# Altium schematic sheet [13] - I2C_EEPROM.SchDoc
size A4
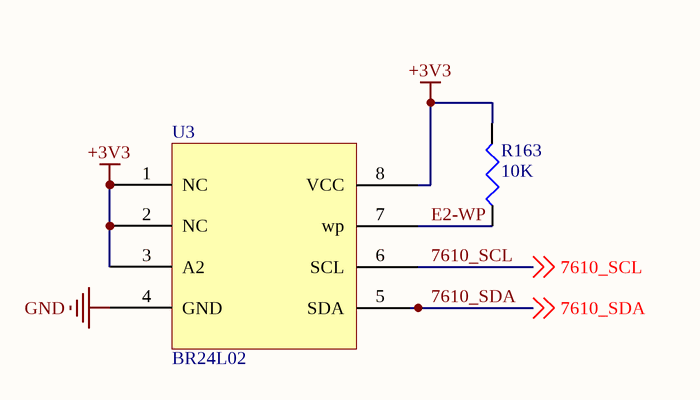
[diagram p0: [13] - I2C_EEPROM.SchDoc]

## Parts
R163  10K  [R0402]
U3  BR24L02  [SO-8]

## Nets
+3V3: R163.2 U3.1(NC) U3.2(NC) U3.3(A2) U3.8(VCC)
GND: U3.4(GND)
7610_SCL: U3.6(SCL) ; off-sheet 7610_SCL
7610_SDA: U3.5(SDA) ; off-sheet 7610_SDA
E2-WP: R163.1 U3.7(wp)

## Library data of the parts
R163 = RC0402FR-071RL: RES 1.00 OHM 1/16W 1% 0402 SM; Manufacturer: Yageo; Resistance (Ohms): 1; Power (Watts): 0.063W, 1/16W; Tolerance: ?%; Value: 1R; .Checked PCB: used; Temperature Coefficient: ?00ppm/癈; Category: Resistors; Manufacturer Part Number: RC0402FR-071RL; Package / Case: 0402 (1005 Metric); Price 1k [$]: 0.01421; .Checked SCH: used; Supplier Part Number: 311-1.00LRCT-ND; Supplier: Digikey; Supplier 1: Digi-Key; Supplier Part Number 1: 311-1.00LRCT-ND; RoHS: RoHS Compliant; Stock 1: 347765; Pricing 1: 10=0.019, 50=0.0142, 100=0.0109, 250=0.00808, 500=0.00596, 1000=0.00397 (USD); Composition: Thick Film; Features: -; Size / Dimension: 0.039" L x 0.020" W (1.00mm x 0.50mm); Height: 0.016" (0.40mm); Number of Terminations: 2; Packaging: Cut Tape (CT); ComponentLink1URL: http://www.yageo.com/documents/recent/PYu-RC0402_51_RoHS_L_6.pdf; ComponentLink1Description: http://www.yageo.com/documents/recent/PYu-RC0402_51_RoHS_L_6.pdf
U3 = 24C08AN